# Altium schematic sheet pwm-enable.SchDoc
size A3
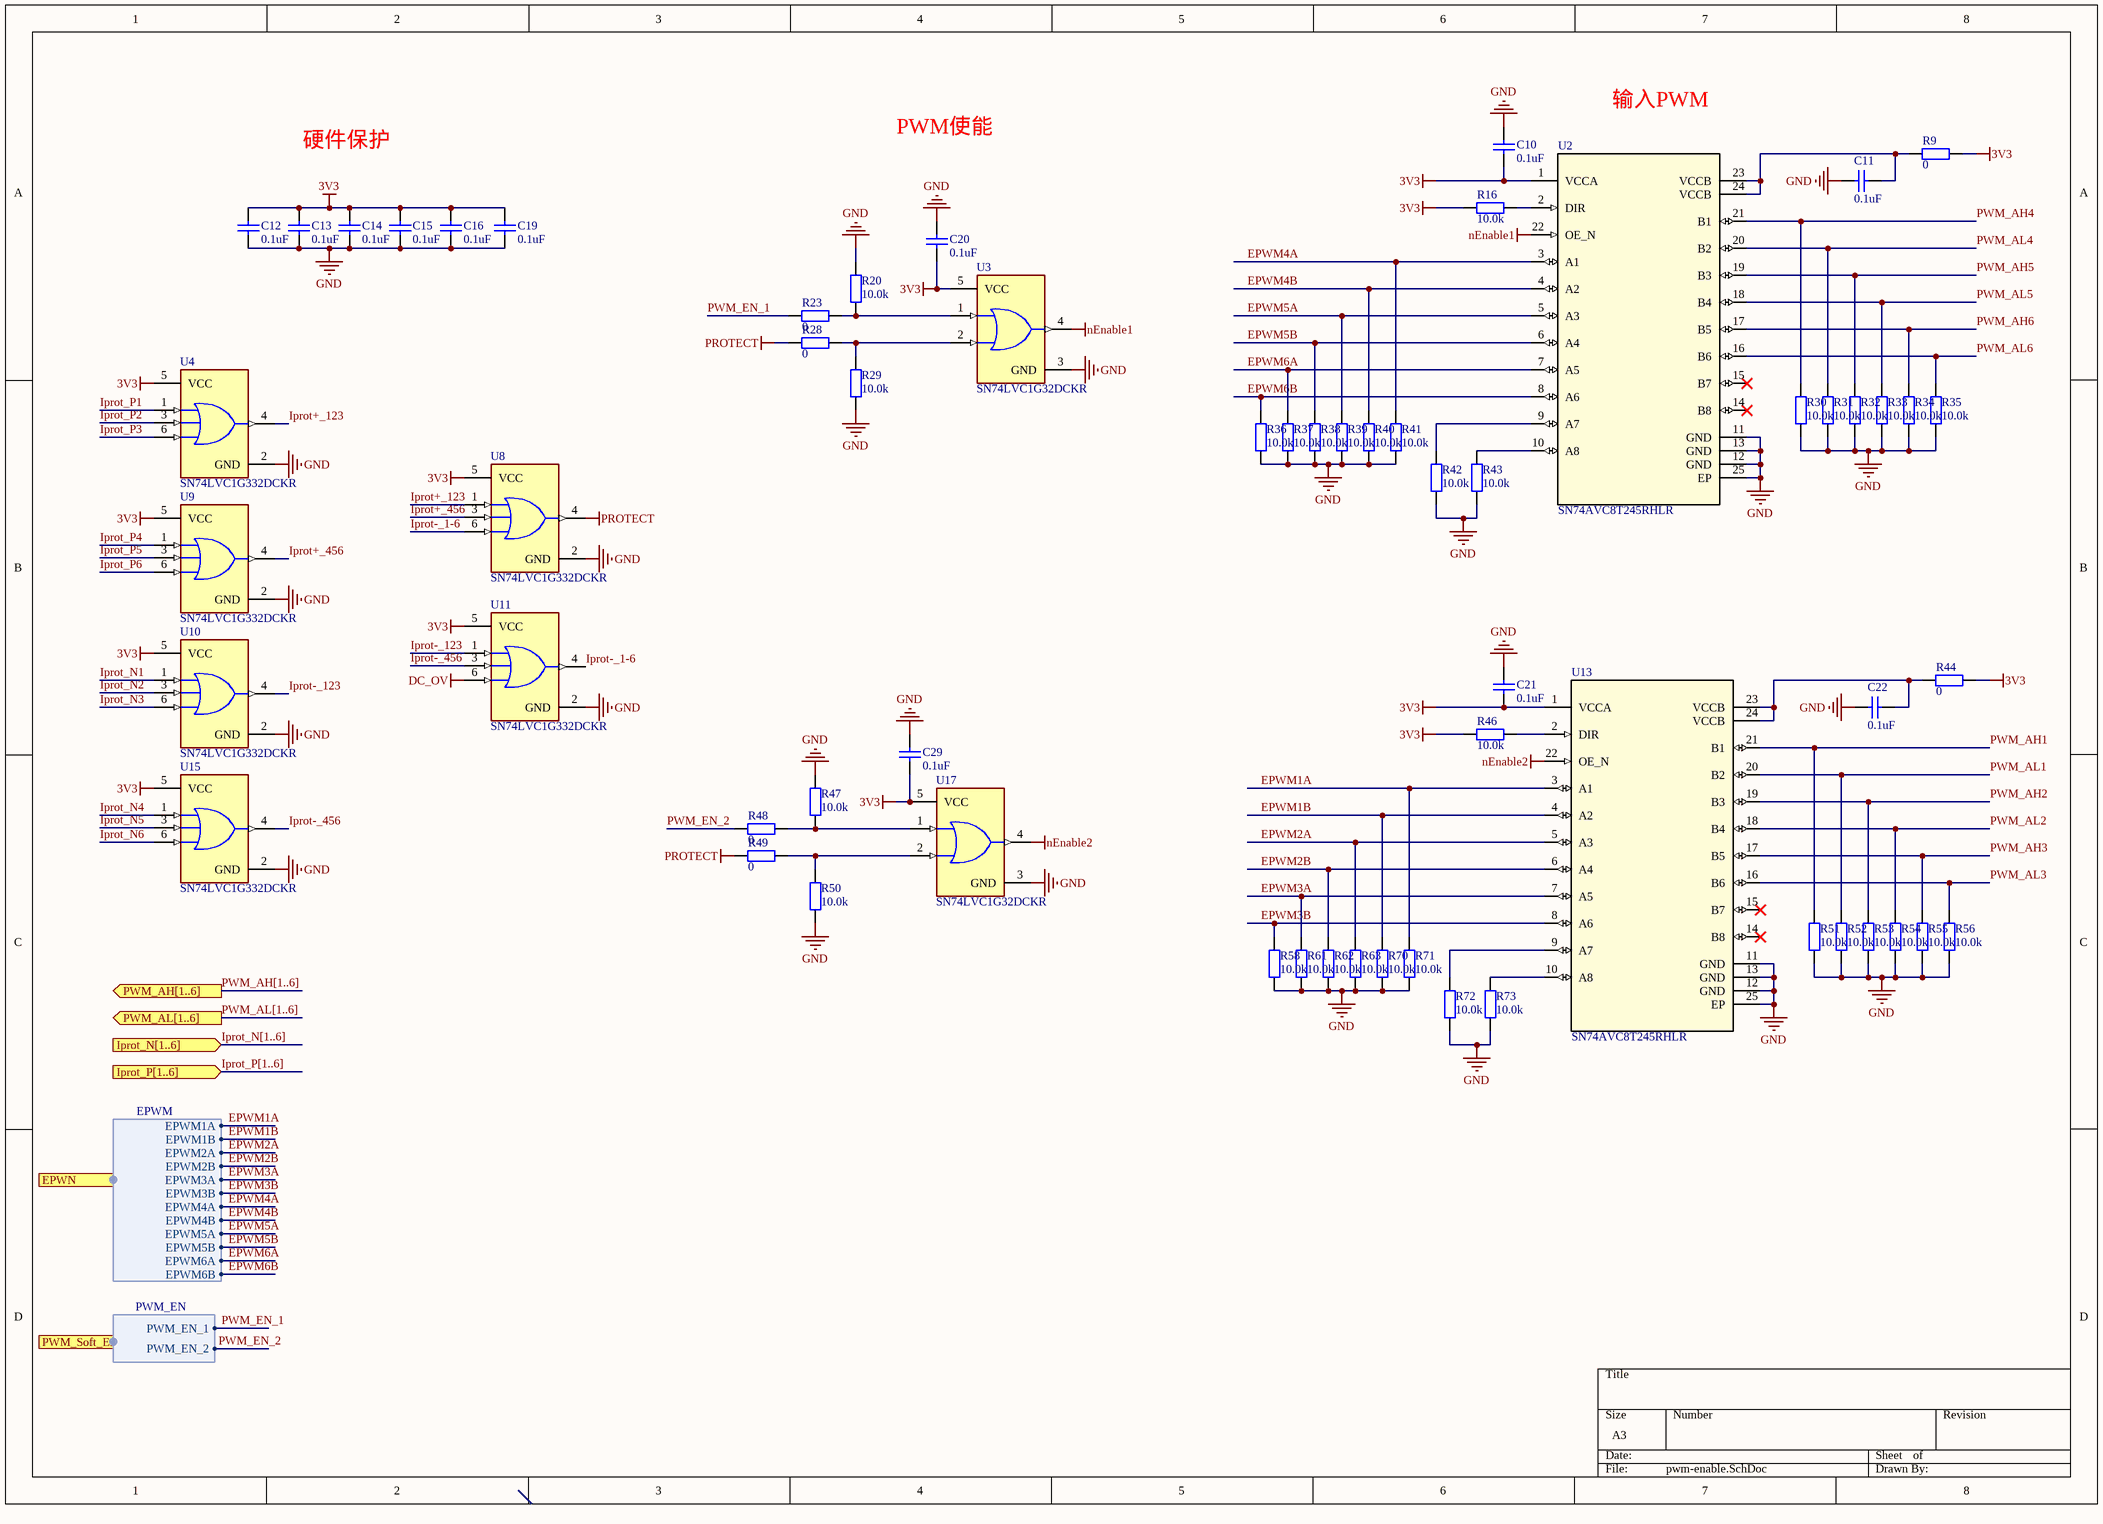
[diagram p0: pwm-enable.SchDoc]

## Parts
C10  0.1uF  [CAPC1608X06N]
C11  0.1uF  [CAPC1608X06N]
C12  0.1uF  [CAPC1608X06N]
C13  0.1uF  [CAPC1608X06N]
C14  0.1uF  [CAPC1608X06N]
C15  0.1uF  [CAPC1608X06N]
C16  0.1uF  [CAPC1608X06N]
C19  0.1uF  [CAPC1608X06N]
C20  0.1uF  [CAPC1608X06N]
C21  0.1uF  [CAPC1608X06N]
C22  0.1uF  [CAPC1608X06N]
C29  0.1uF  [CAPC1608X06N]
R9  0  [RESC1608X05N]
R16  10.0k  [RESC1608X05N]
R20  10.0k  [RESC1608X05N]
R23  0  [RESC1608X05N]
R28  0  [RESC1608X05N]
R29  10.0k  [RESC1608X05N]
R30  10.0k  [RESC1608X05N]
R31  10.0k  [RESC1608X05N]
R32  10.0k  [RESC1608X05N]
R33  10.0k  [RESC1608X05N]
R34  10.0k  [RESC1608X05N]
R35  10.0k  [RESC1608X05N]
R36  10.0k  [RESC1608X05N]
R37  10.0k  [RESC1608X05N]
R38  10.0k  [RESC1608X05N]
R39  10.0k  [RESC1608X05N]
R40  10.0k  [RESC1608X05N]
R41  10.0k  [RESC1608X05N]
R42  10.0k  [RESC1608X05N]
R43  10.0k  [RESC1608X05N]
R44  0  [RESC1608X05N]
R46  10.0k  [RESC1608X05N]
R47  10.0k  [RESC1608X05N]
R48  0  [RESC1608X05N]
R49  0  [RESC1608X05N]
R50  10.0k  [RESC1608X05N]
R51  10.0k  [RESC1608X05N]
R52  10.0k  [RESC1608X05N]
R53  10.0k  [RESC1608X05N]
R54  10.0k  [RESC1608X05N]
R55  10.0k  [RESC1608X05N]
R56  10.0k  [RESC1608X05N]
R58  10.0k  [RESC1608X05N]
R61  10.0k  [RESC1608X05N]
R62  10.0k  [RESC1608X05N]
R63  10.0k  [RESC1608X05N]
R70  10.0k  [RESC1608X05N]
R71  10.0k  [RESC1608X05N]
R72  10.0k  [RESC1608X05N]
R73  10.0k  [RESC1608X05N]
U2  SN74AVC8T245RHLR  [RHL0024A]
U3  SN74LVC1G32DCKR  [FP-DCK0005A-IPC_A]
U4  SN74LVC1G332DCKR  [FP-DCK0006A-MFG]
U8  SN74LVC1G332DCKR  [FP-DCK0006A-MFG]
U9  SN74LVC1G332DCKR  [FP-DCK0006A-MFG]
U10  SN74LVC1G332DCKR  [FP-DCK0006A-MFG]
U11  SN74LVC1G332DCKR  [FP-DCK0006A-MFG]
U13  SN74AVC8T245RHLR  [RHL0024A]
U15  SN74LVC1G332DCKR  [FP-DCK0006A-MFG]
U17  SN74LVC1G32DCKR  [FP-DCK0005A-IPC_A]

## Ports
EPWN (harness EPWM), Iprot_N[1..6] (in), Iprot_P[1..6] (in), PWM_AH[1..6] (out), PWM_AL[1..6] (out), PWM_Soft_Enable (harness PWM_EN)

## Harnesses
EPWM: EPWM1A, EPWM2A, EPWM2B, EPWM3A, EPWM3B, EPWM1B, EPWM4A, EPWM4B, EPWM5A, EPWM5B, EPWM6A, EPWM6B
PWM_EN: PWM_EN_1, PWM_EN_2

## Nets
3V3: C10.1 C12.1 C13.1 C14.1 C15.1 C16.1 C19.1 C20.1 C21.1 C29.1 R9.2 R16.1 R44.2 R46.1 U2.1(VCCA) U3.5(VCC) U4.5(VCC) U8.5(VCC) U9.5(VCC) U10.5(VCC) U11.5(VCC) U13.1(VCCA) U15.5(VCC) U17.5(VCC)
DC_OV: U11.6(C)
GND: C10.2 C11.2 C12.2 C13.2 C14.2 C15.2 C16.2 C19.2 C20.2 C21.2 C22.2 C29.2 R20.1 R29.1 R30.2 R31.2 R32.2 R33.2 R34.2 R35.2 R36.1 R37.1 R38.1 R39.2 R40.1 R41.1 R42.2 R43.2 R47.1 R50.1 R51.2 R52.2 R53.2 R54.2 R55.2 R56.2 R58.1 R61.1 R62.1 R63.2 R70.1 R71.1 R72.2 R73.2 U2.11(GND) U2.12(GND) U2.13(GND) U2.25(EP) U3.3(GND) U4.2(GND) U8.2(GND) U9.2(GND) U10.2(GND) U11.2(GND) U13.11(GND) U13.12(GND) U13.13(GND) U13.25(EP) U15.2(GND) U17.3(GND)
nEnable1: U2.22(OE_N) U3.4(Y)
nEnable2: U13.22(OE_N) U17.4(Y)
PROTECT: R28.1 R49.1 U8.4(Y)
EPWM1A: R71.2 U13.3(A1) ; port EPWN.EPWM1A
EPWM1B: R70.2 U13.4(A2) ; port EPWN.EPWM1B
EPWM2A: R63.1 U13.5(A3) ; port EPWN.EPWM2A
EPWM2B: R62.2 U13.6(A4) ; port EPWN.EPWM2B
EPWM3A: R61.2 U13.7(A5) ; port EPWN.EPWM3A
EPWM3B: R58.2 U13.8(A6) ; port EPWN.EPWM3B
EPWM4A: R41.2 U2.3(A1) ; port EPWN.EPWM4A
EPWM4B: R40.2 U2.4(A2) ; port EPWN.EPWM4B
EPWM5A: R39.1 U2.5(A3) ; port EPWN.EPWM5A
EPWM5B: R38.2 U2.6(A4) ; port EPWN.EPWM5B
EPWM6A: R37.2 U2.7(A5) ; port EPWN.EPWM6A
EPWM6B: R36.2 U2.8(A6) ; port EPWN.EPWM6B
Iprot+_123: U4.4(Y) U8.1(A)
Iprot+_456: U8.3(B) U9.4(Y)
Iprot-_1-6: U8.6(C) U11.4(Y)
Iprot-_123: U10.4(Y) U11.1(A)
Iprot-_456: U11.3(B) U15.4(Y)
Iprot_N1: U10.1(A)
Iprot_N2: U10.3(B)
Iprot_N3: U10.6(C)
Iprot_N4: U15.1(A)
Iprot_N5: U15.3(B)
Iprot_N6: U15.6(C)
Iprot_P1: U4.1(A)
Iprot_P2: U4.3(B)
Iprot_P3: U4.6(C)
Iprot_P4: U9.1(A)
Iprot_P5: U9.3(B)
Iprot_P6: U9.6(C)
PWM_AH1: R51.1 U13.21(B1)
PWM_AH2: R53.1 U13.19(B3)
PWM_AH3: R55.1 U13.17(B5)
PWM_AH4: R30.1 U2.21(B1)
PWM_AH5: R32.1 U2.19(B3)
PWM_AH6: R34.1 U2.17(B5)
PWM_AL1: R52.1 U13.20(B2)
PWM_AL2: R54.1 U13.18(B4)
PWM_AL3: R56.1 U13.16(B6)
PWM_AL4: R31.1 U2.20(B2)
PWM_AL5: R33.1 U2.18(B4)
PWM_AL6: R35.1 U2.16(B6)
PWM_EN_1: R23.1 ; port PWM_Soft_Enable.PWM_EN_1
PWM_EN_2: R48.1 ; port PWM_Soft_Enable.PWM_EN_2
NetC11_1: C11.1 R9.1 U2.23(VCCB) U2.24(VCCB)
NetC22_1: C22.1 R44.1 U13.23(VCCB) U13.24(VCCB)
NetR16_2: R16.2 U2.2(DIR)
NetR20_2: R20.2 R23.2 U3.1(A)
NetR28_2: R28.2 R29.2 U3.2(B)
NetR42_1: R42.1 U2.9(A7)
NetR43_1: R43.1 U2.10(A8)
NetR46_2: R46.2 U13.2(DIR)
NetR47_2: R47.2 R48.2 U17.1(A)
NetR49_2: R49.2 R50.2 U17.2(B)
NetR72_1: R72.1 U13.9(A7)
NetR73_1: R73.1 U13.10(A8)

Not connected (* = marked no-connect by the designer): U2 14(B8)* 15(B7)*; U13 14(B8)* 15(B7)*

## Buses and harness runs
bus Iprot_N[1..6] = port Iprot_N[1..6]
bus Iprot_P[1..6] = port Iprot_P[1..6]
bus PWM_AH[1..6] = port PWM_AH[1..6]
bus PWM_AL[1..6] = port PWM_AL[1..6]

## Notes on the sheet
- 输入PWM
- 硬件保护
- PWM使能

## Library data of the parts
C10-C16 C19-C22 C29 = Cap: Capacitor; Published: 8-Jun-2000; LatestRevisionDate: 17-Jul-2002; LatestRevisionNote: Re-released for DXP Platform.; PackageReference: RAD-0.3; Publisher: Altium Limited; PackageDescription: Radial Cap, Thru-Hole; 2 Leads; 0.3 in Pin Spacing; Value: 0.1uF
R9 R44 = Res: Resistor 0402; Value: K; Published: 8-Jun-2000; LatestRevisionDate: 17-Jul-2002; LatestRevisionNote: Re-released for DXP Platform.; PackageReference: AXIAL-0.4; Publisher: Altium Limited; PackageDescription: Axial Device, Thru-Hole; 2 Leads; 0.4 in Pin Spacing
R16 R20 R23 R28-R43 R46-R56 R58 R61-R63 R70-R73 = 0603 100KΩ (1003) 1%_4: 贴片电阻; Value: 1MΩ(1%); ComponentLink1Description: 供应商链接; ComponentLink1URL: http://www.szlcsc.com/product/details_26546.html; Package: 0603; Supplier: LC; SuppliersPartNumber: C25803
U2 = SN74AVC8T245RHLR: No Description Available(1.2-3.6V); Mfr_Name: Texas Instruments; CompType: IC; Type: DEV; RefDes: RefDes; Copyright: Copyright (C) 2024 Ultra Librarian. All rights reserved.; Manufacturer_Part_Number: SN74AVC8T245RHLR; PartNumber: SN74AVC8T245RHL; PackageReference: RHL0024A; MountType: SMT; RoHS: Y; Manufacturer: Texas Instruments
U3 U17 = CMP-0859-00376-4: IC GATE OR 1CH 2-INP SC70-5(1.65-5.5V); Turn-On Delay Time: 4.5ns; Schmitt Trigger Input: No; Number of Bits: 1; High Level Output Current: -32mA; Max Supply Voltage: 5.5V; Propagation Delay: 4ns; Max Output Current: 32mA; Min Supply Voltage: 1.65V; Number of Input Lines: 2; Quiescent Current: 10uA; Case/Package: SC; Weight: 8.8E-05oz; Logic Function: OR; Package Quantity: 1; Packaging: Tape and Reel; Mount: Surface Mount; Max Operating Temperature: 125°C; Output Current: 32mA; Length: 2mm; Contact Plating: Gold; Number of Output Lines: 1; Height: 0.9mm; Number of Pins: 5; Width: 1.25mm; REACH SVHC: No SVHC; Number of Circuits: 1; Radiation Hardening: No; Number of Elements: 1; Low Level Output Current: 32mA; Number of Outputs: 1; Min Operating Temperature: -40°C; Number of Inputs: 2; Lead Free: Lead Free; Termination: SMD/SMT; Number of Gates: 1
U4 U8-U11 U15 = CMP-0859-00464-4: IC GATE OR 1CH 3-INP SC70-6; Manufacturer: Texas Instruments; Min Supply Voltage: 1.65V; Number Of Circuits: 1; Nominal Supply Current: 10uA; Number Of Inputs: 3; Max Supply Voltage: 5.5V; Propagation Delay: 20ns; Standoff Height: 0mm; Logic Function Desc: Non-Inverting; Manufacturer Part Number: SN74LVC1G332DCKR; Automotive: No; Temperature: -40°C to +125°C; Device Class L1: Integrated Circuits (ICs); ComponentLink2URL: http://www.ti.com/lit/ds/symlink/sn74lvc1g332.pdf; RoHS: TRUE; Digikey Description: IC GATE OR 1CH 3-INP SC70-6; Octopart: https://octopart.com/sn74lvc1g332dckr-texas+instruments-464861; Ambient Temperature Range Low: -40°C; Number Of Outputs: 1; Height: 1.1mm; Device Class L2: Logic ICs; Mouser Description: Logic Gates Single 3-Input Pos- OR Gate; ComponentLink2Description: Datasheet; Package: DCK0006A; Temperature Range Low: -40°C; Ambient Temperature Range High: +125°C; Temperature Range High: +125°C; Category: IC; Device Class L3: Logic Gates; Lead Free: Yes
U13 = SN74AVC8T245RHLR: No Description Available; Mfr_Name: Texas Instruments; CompType: IC; Type: DEV; RefDes: RefDes; Copyright: Copyright (C) 2024 Ultra Librarian. All rights reserved.; Manufacturer_Part_Number: SN74AVC8T245RHLR; PartNumber: SN74AVC8T245RHL; PackageReference: RHL0024A; MountType: SMT; RoHS: Y; Manufacturer: Texas Instruments